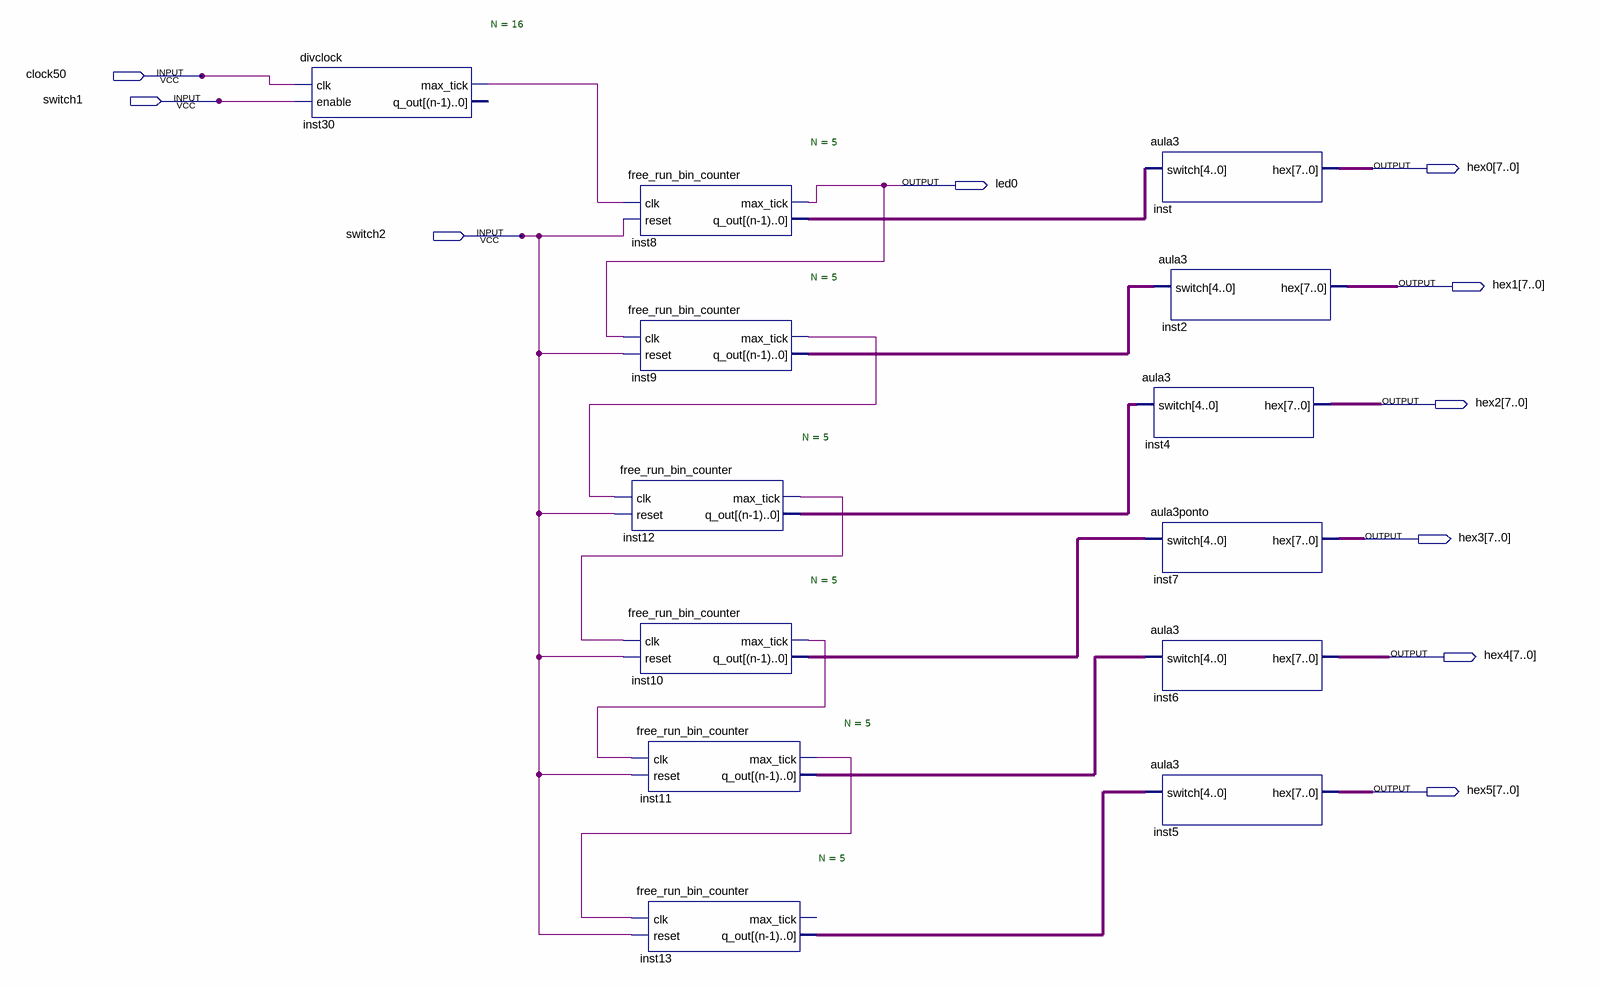
[diagram p0: schematic sheet]
// Quartus schematic top.bdf as structural Verilog: 13 symbols, 10 pins
module top (
  input  clock50,
  input  switch1,
  input  switch2,
  output [7:0] hex0,
  output led0,
  output [7:0] hex1,
  output [7:0] hex2,
  output [7:0] hex3,
  output [7:0] hex4,
  output [7:0] hex5
);

  wire inst9_max_tick, inst10_max_tick, inst11_max_tick, inst12_max_tick, inst30_max_tick;
  wire [4:0] inst8_q_out, inst9_q_out, inst10_q_out, inst11_q_out, inst12_q_out, inst13_q_out;

  divclock #(.N(16)) inst30 (.clk(clock50), .enable(switch1), .max_tick(inst30_max_tick));  // open: q_out
  free_run_bin_counter #(.N(5)) inst8 (.clk(inst30_max_tick), .reset(switch2), .max_tick(led0), .q_out(inst8_q_out));
  free_run_bin_counter #(.N(5)) inst9 (.clk(led0), .reset(switch2), .max_tick(inst9_max_tick), .q_out(inst9_q_out));
  free_run_bin_counter #(.N(5)) inst12 (
    .clk(inst9_max_tick), .reset(switch2), .max_tick(inst12_max_tick), .q_out(inst12_q_out));
  free_run_bin_counter #(.N(5)) inst10 (
    .clk(inst12_max_tick), .reset(switch2), .max_tick(inst10_max_tick), .q_out(inst10_q_out));
  free_run_bin_counter #(.N(5)) inst11 (
    .clk(inst10_max_tick), .reset(switch2), .max_tick(inst11_max_tick), .q_out(inst11_q_out));
  free_run_bin_counter #(.N(5)) inst13 (
    .clk(inst11_max_tick), .reset(switch2), .q_out(inst13_q_out));  // open: max_tick
  aula3 inst (.switch(inst8_q_out), .hex(hex0));
  aula3 inst2 (.switch(inst9_q_out), .hex(hex1));
  aula3 inst4 (.switch(inst12_q_out), .hex(hex2));
  aula3ponto inst7 (.switch(inst10_q_out), .hex(hex3));
  aula3 inst6 (.switch(inst11_q_out), .hex(hex4));
  aula3 inst5 (.switch(inst13_q_out), .hex(hex5));
endmodule
